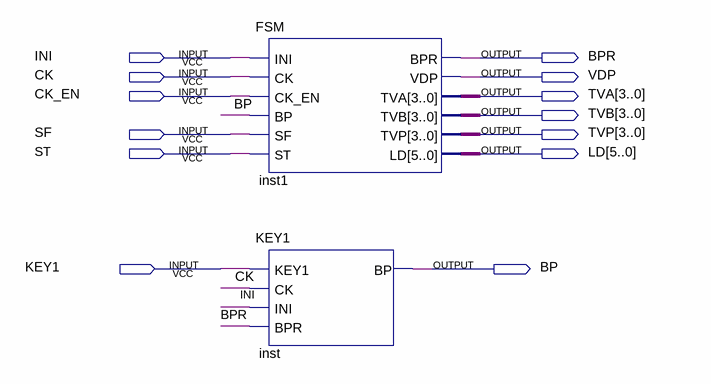
[diagram p0: schematic sheet]
// Quartus schematic Block1.bdf as structural Verilog: 2 symbols, 13 pins
module Block1 (
  input  INI,
  input  CK,
  input  CK_EN,
  input  SF,
  input  ST,
  input  KEY1,
  output BPR,
  output VDP,
  output [3:0] TVA,
  output [3:0] TVB,
  output [3:0] TVP,
  output [5:0] LD,
  output BP
);

  FSM inst1 (
    .INI(INI), .CK(CK), .CK_EN(CK_EN), .BP(BP), .SF(SF), .ST(ST), .BPR(BPR), .VDP(VDP), .TVA(TVA), .TVB(TVB),
    .TVP(TVP), .LD(LD));
  KEY1 inst (.KEY1(KEY1), .CK(CK), .INI(INI), .BPR(BPR), .BP(BP));
endmodule
